# EasyEDA Pro project 电动自行车定位监测终端_v1.0.0.epro, schematic 主板原理图

## Sheets
1 主控芯片: Create Date: 2023-09-03; Page Name: 主控芯片; Project Name: 电动自行车定位监测终端; Schematic Name: 主板原理图; Update Date: 2023-09-07; Company: 合肥工业大学; Drawed: 商文涛; Page Size: A4; Reviewed: 商文涛 / 刘磊; Version: V1.0
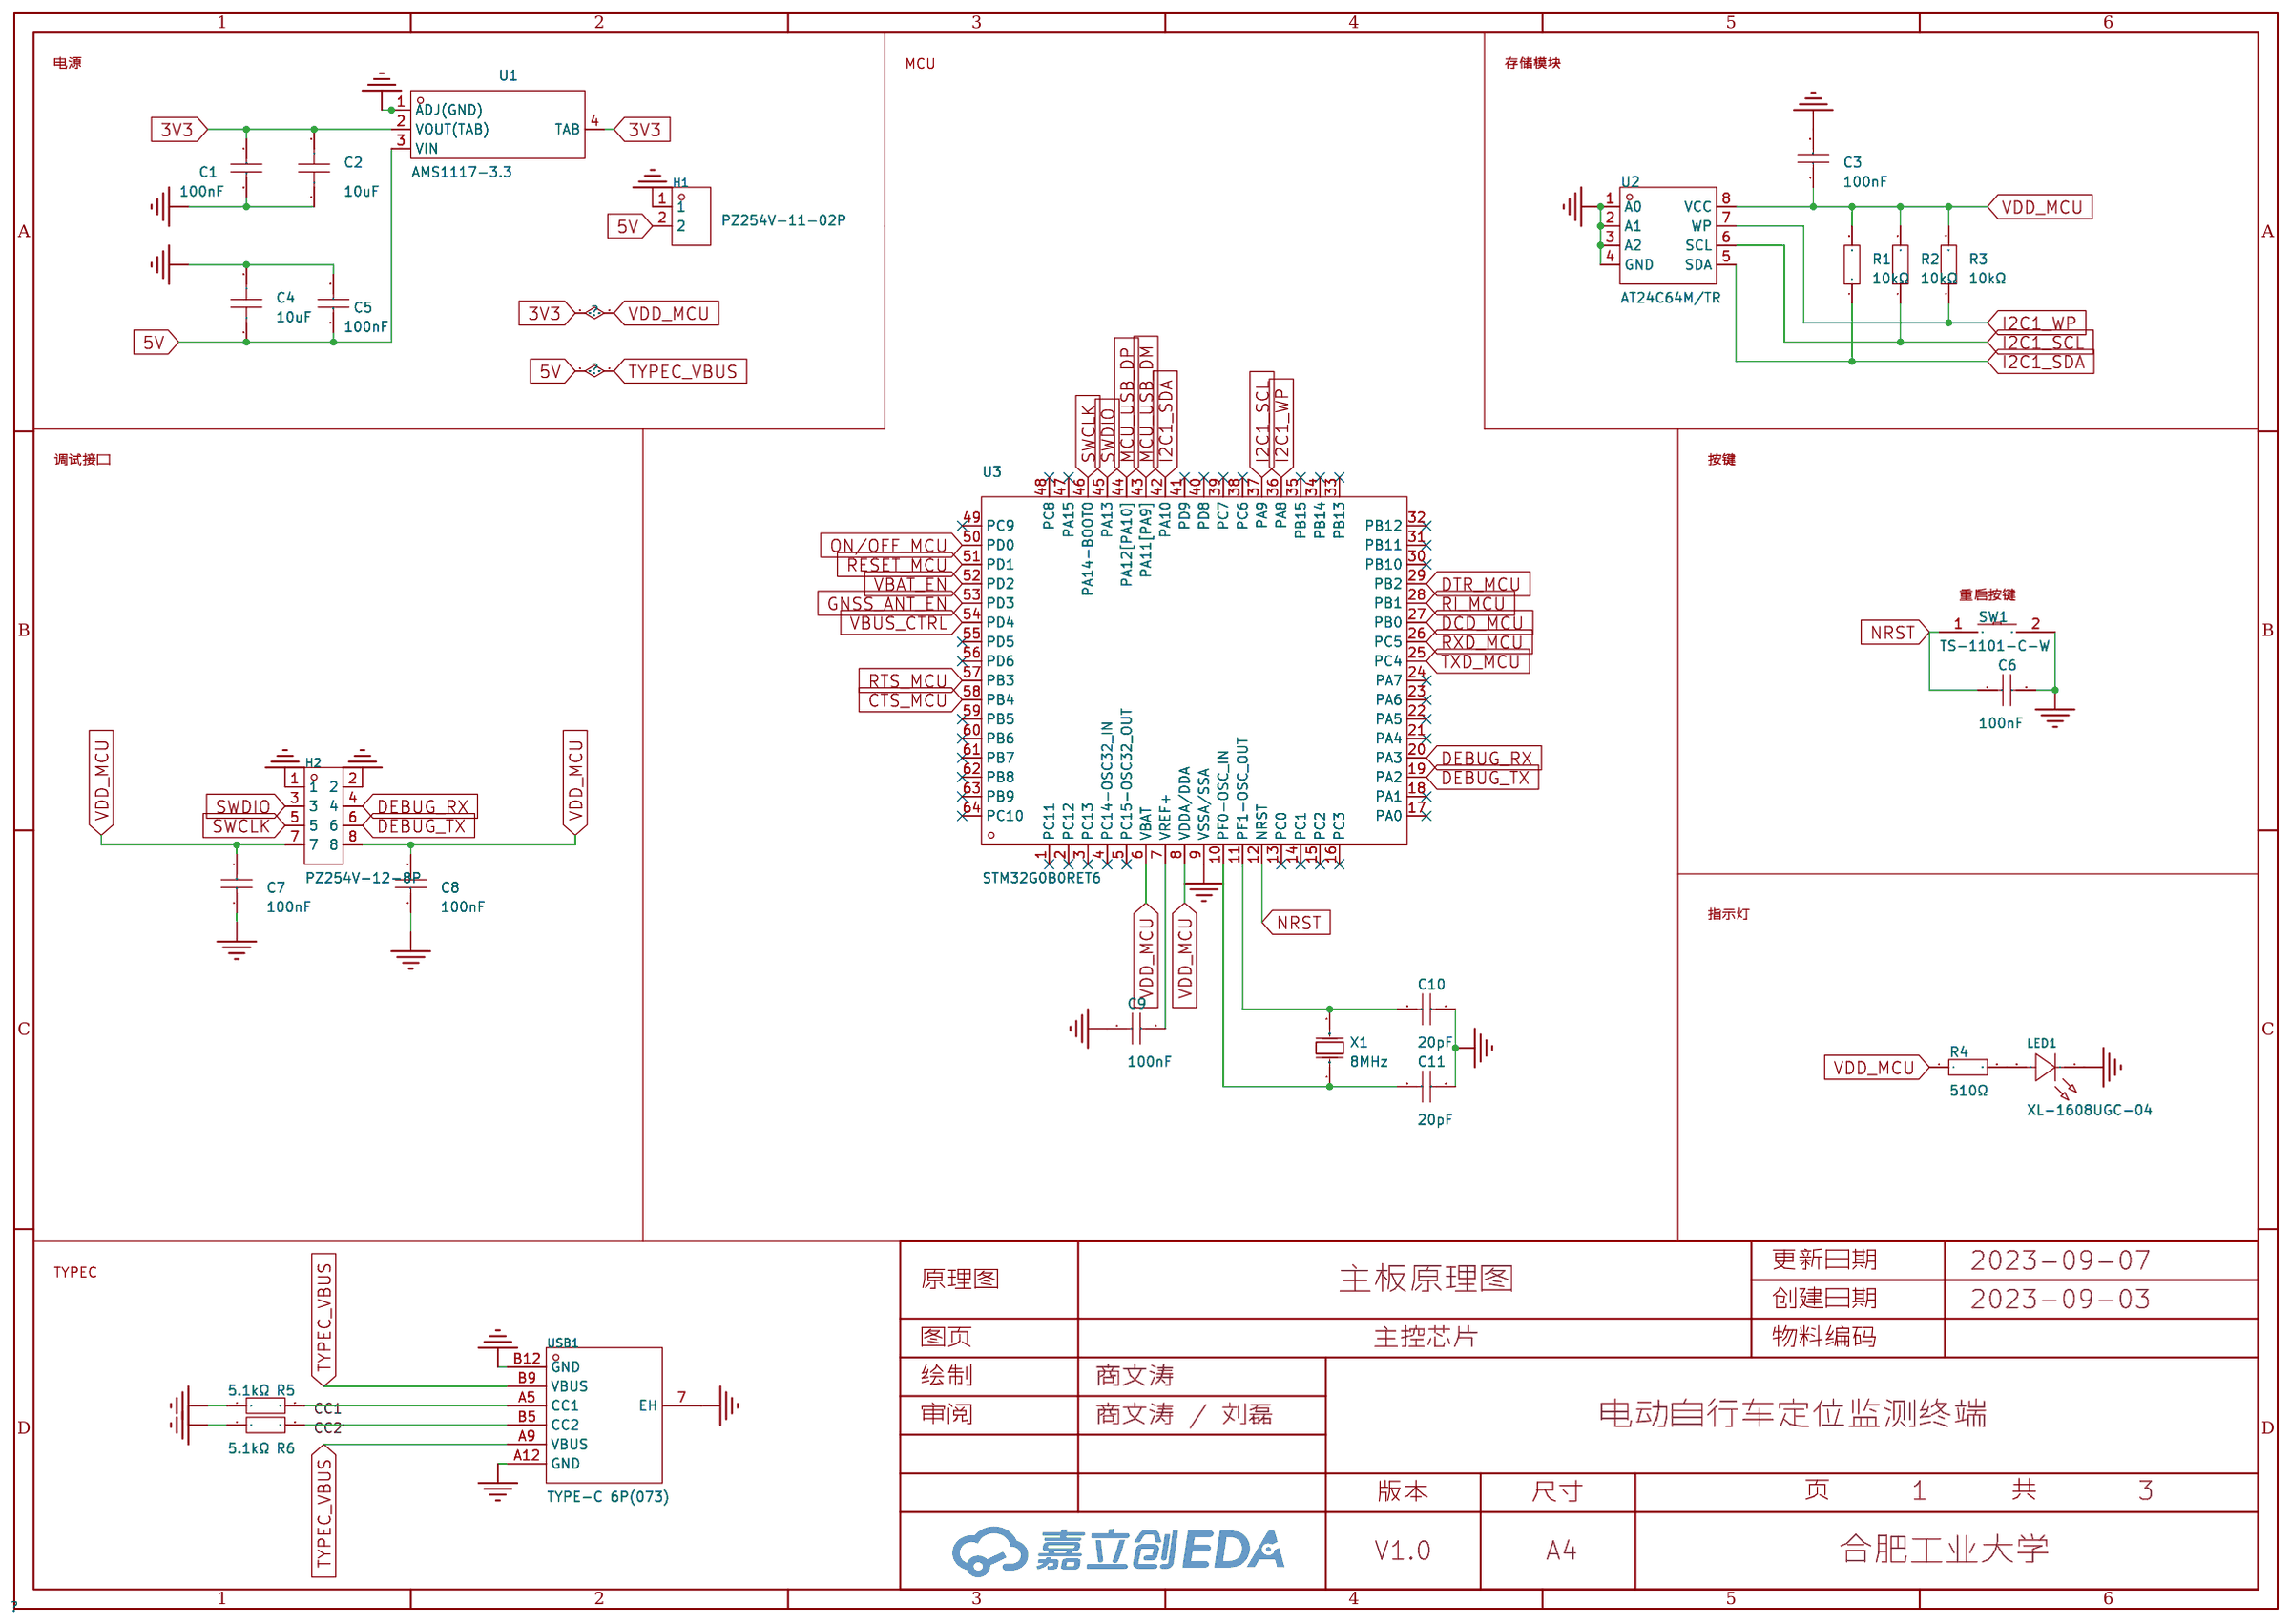
[diagram p0: 主控芯片]
2 数传芯片: Create Date: 2023-09-04; Page Name: 数传芯片; Update Date: 2023-09-06
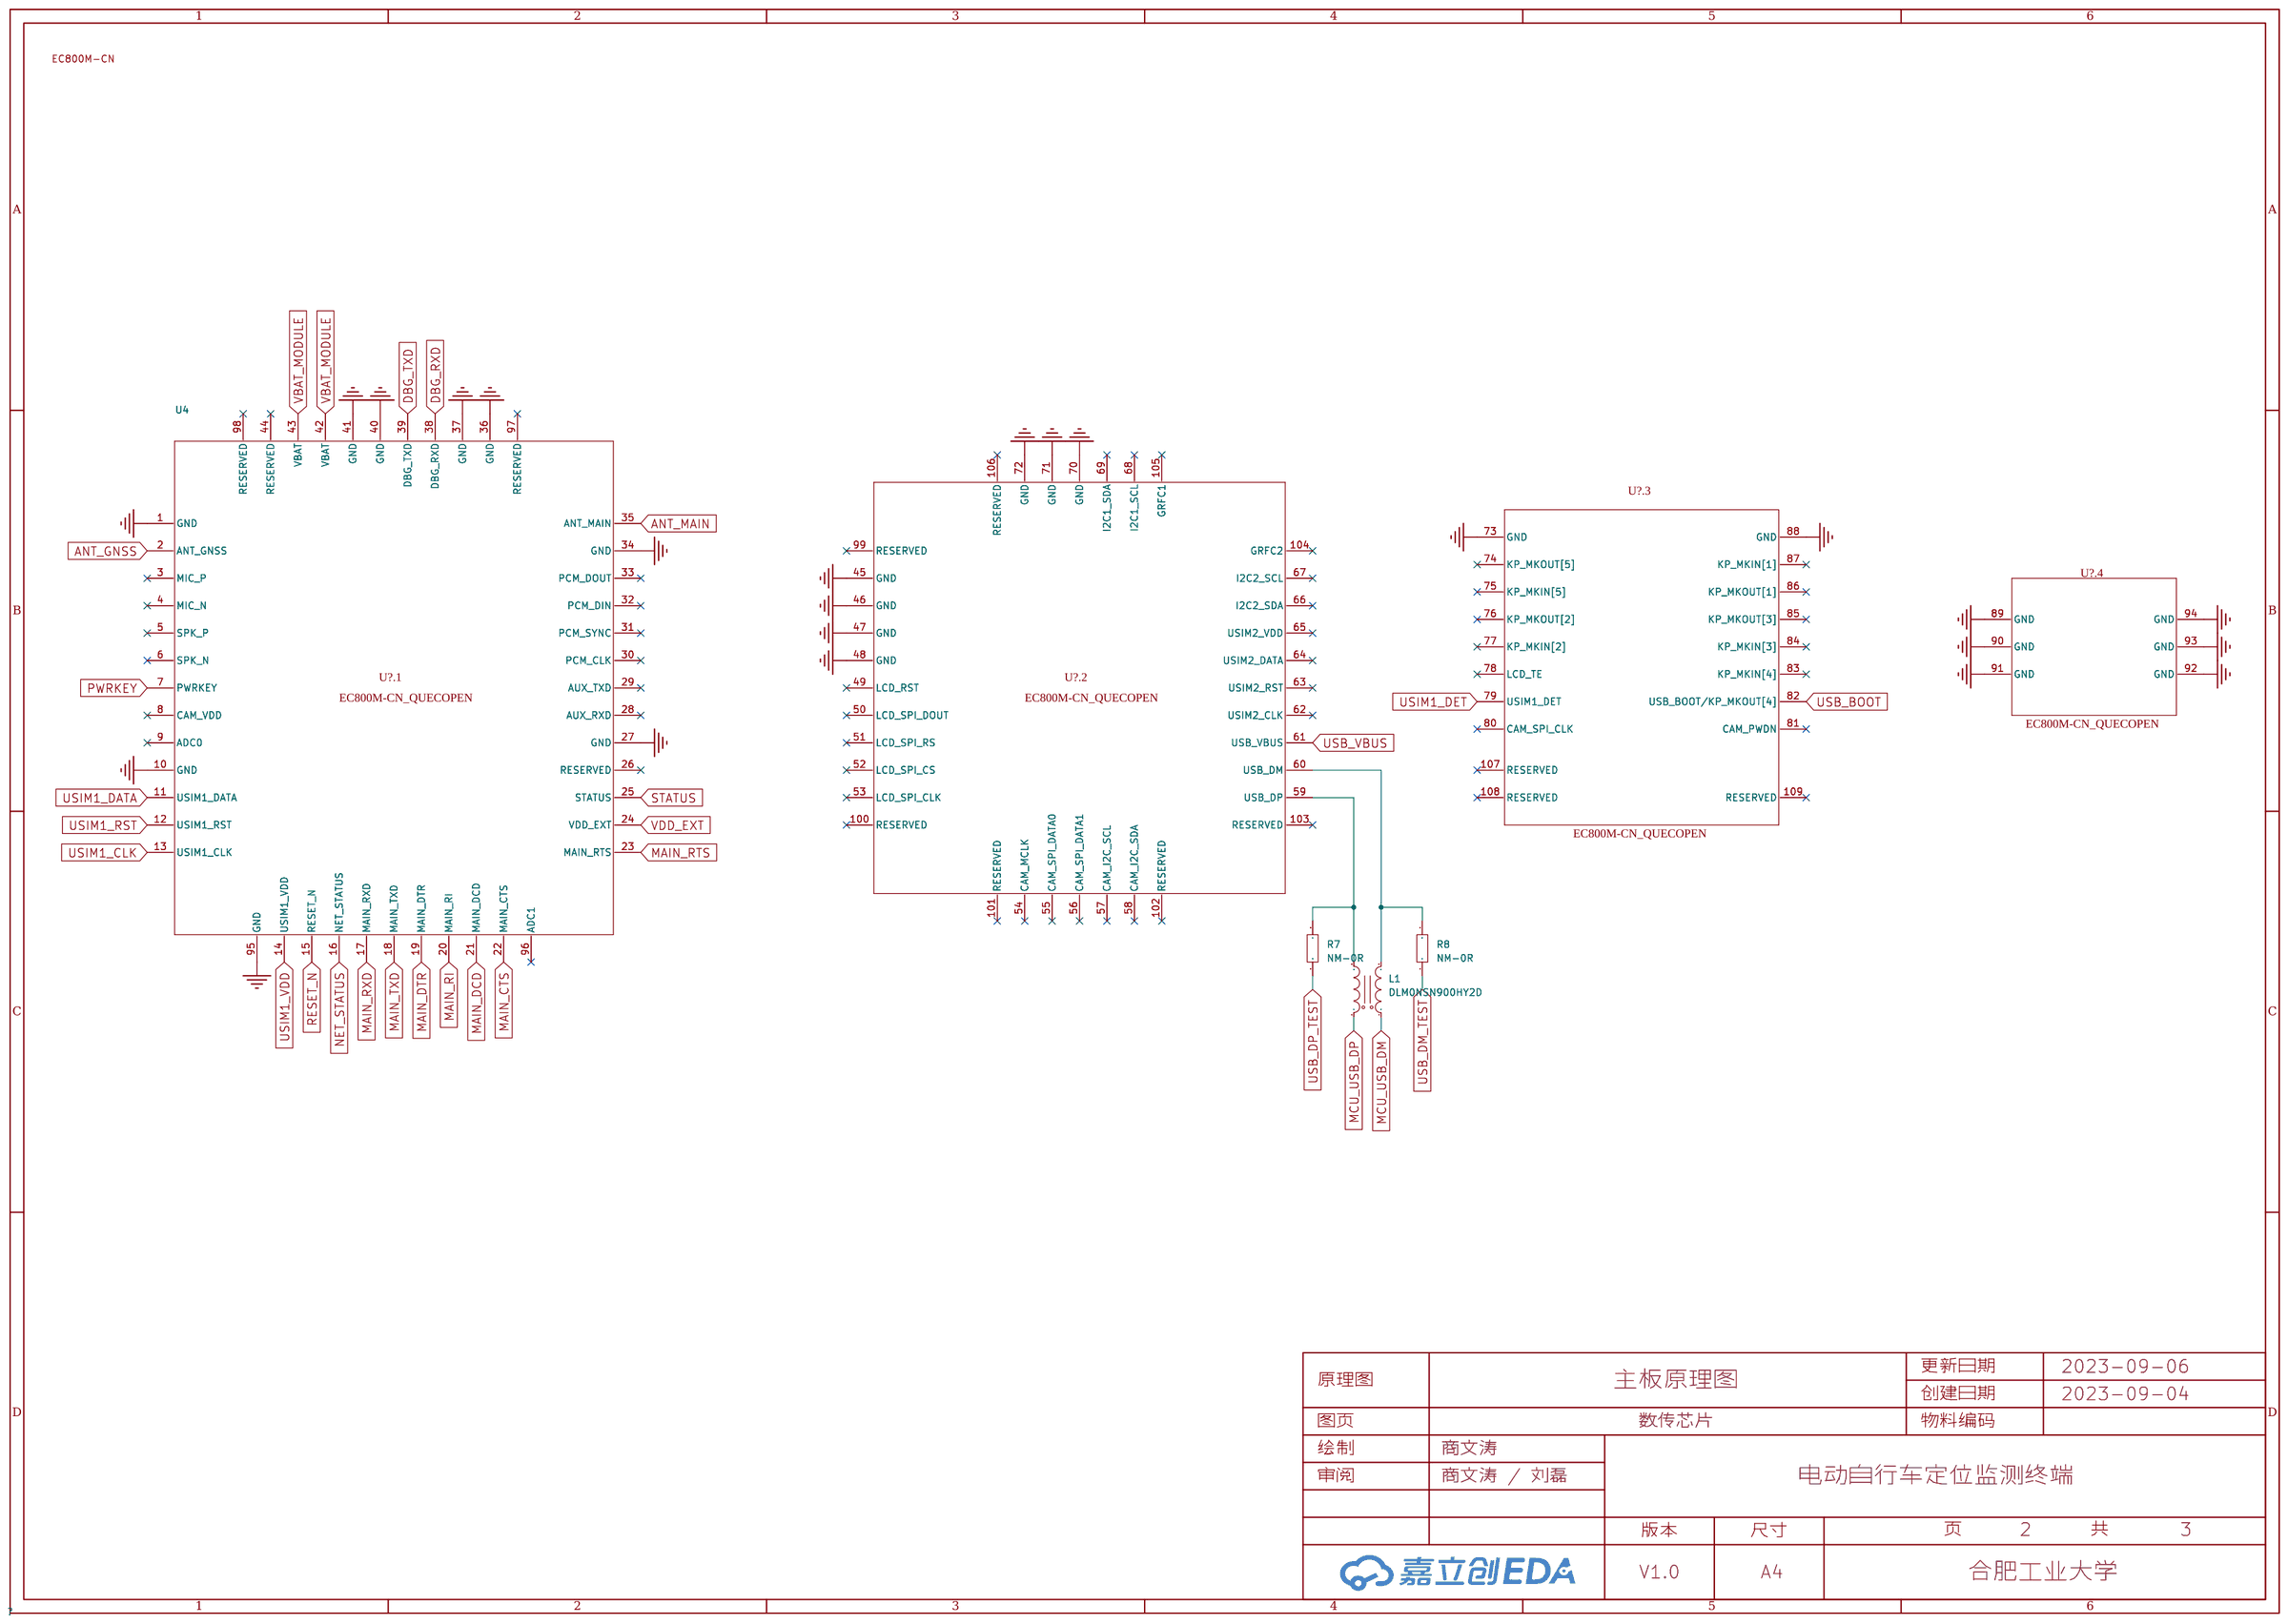
[diagram p1: 数传芯片]
3 功能模块: Create Date: 2023-09-04; Page Name: 功能模块
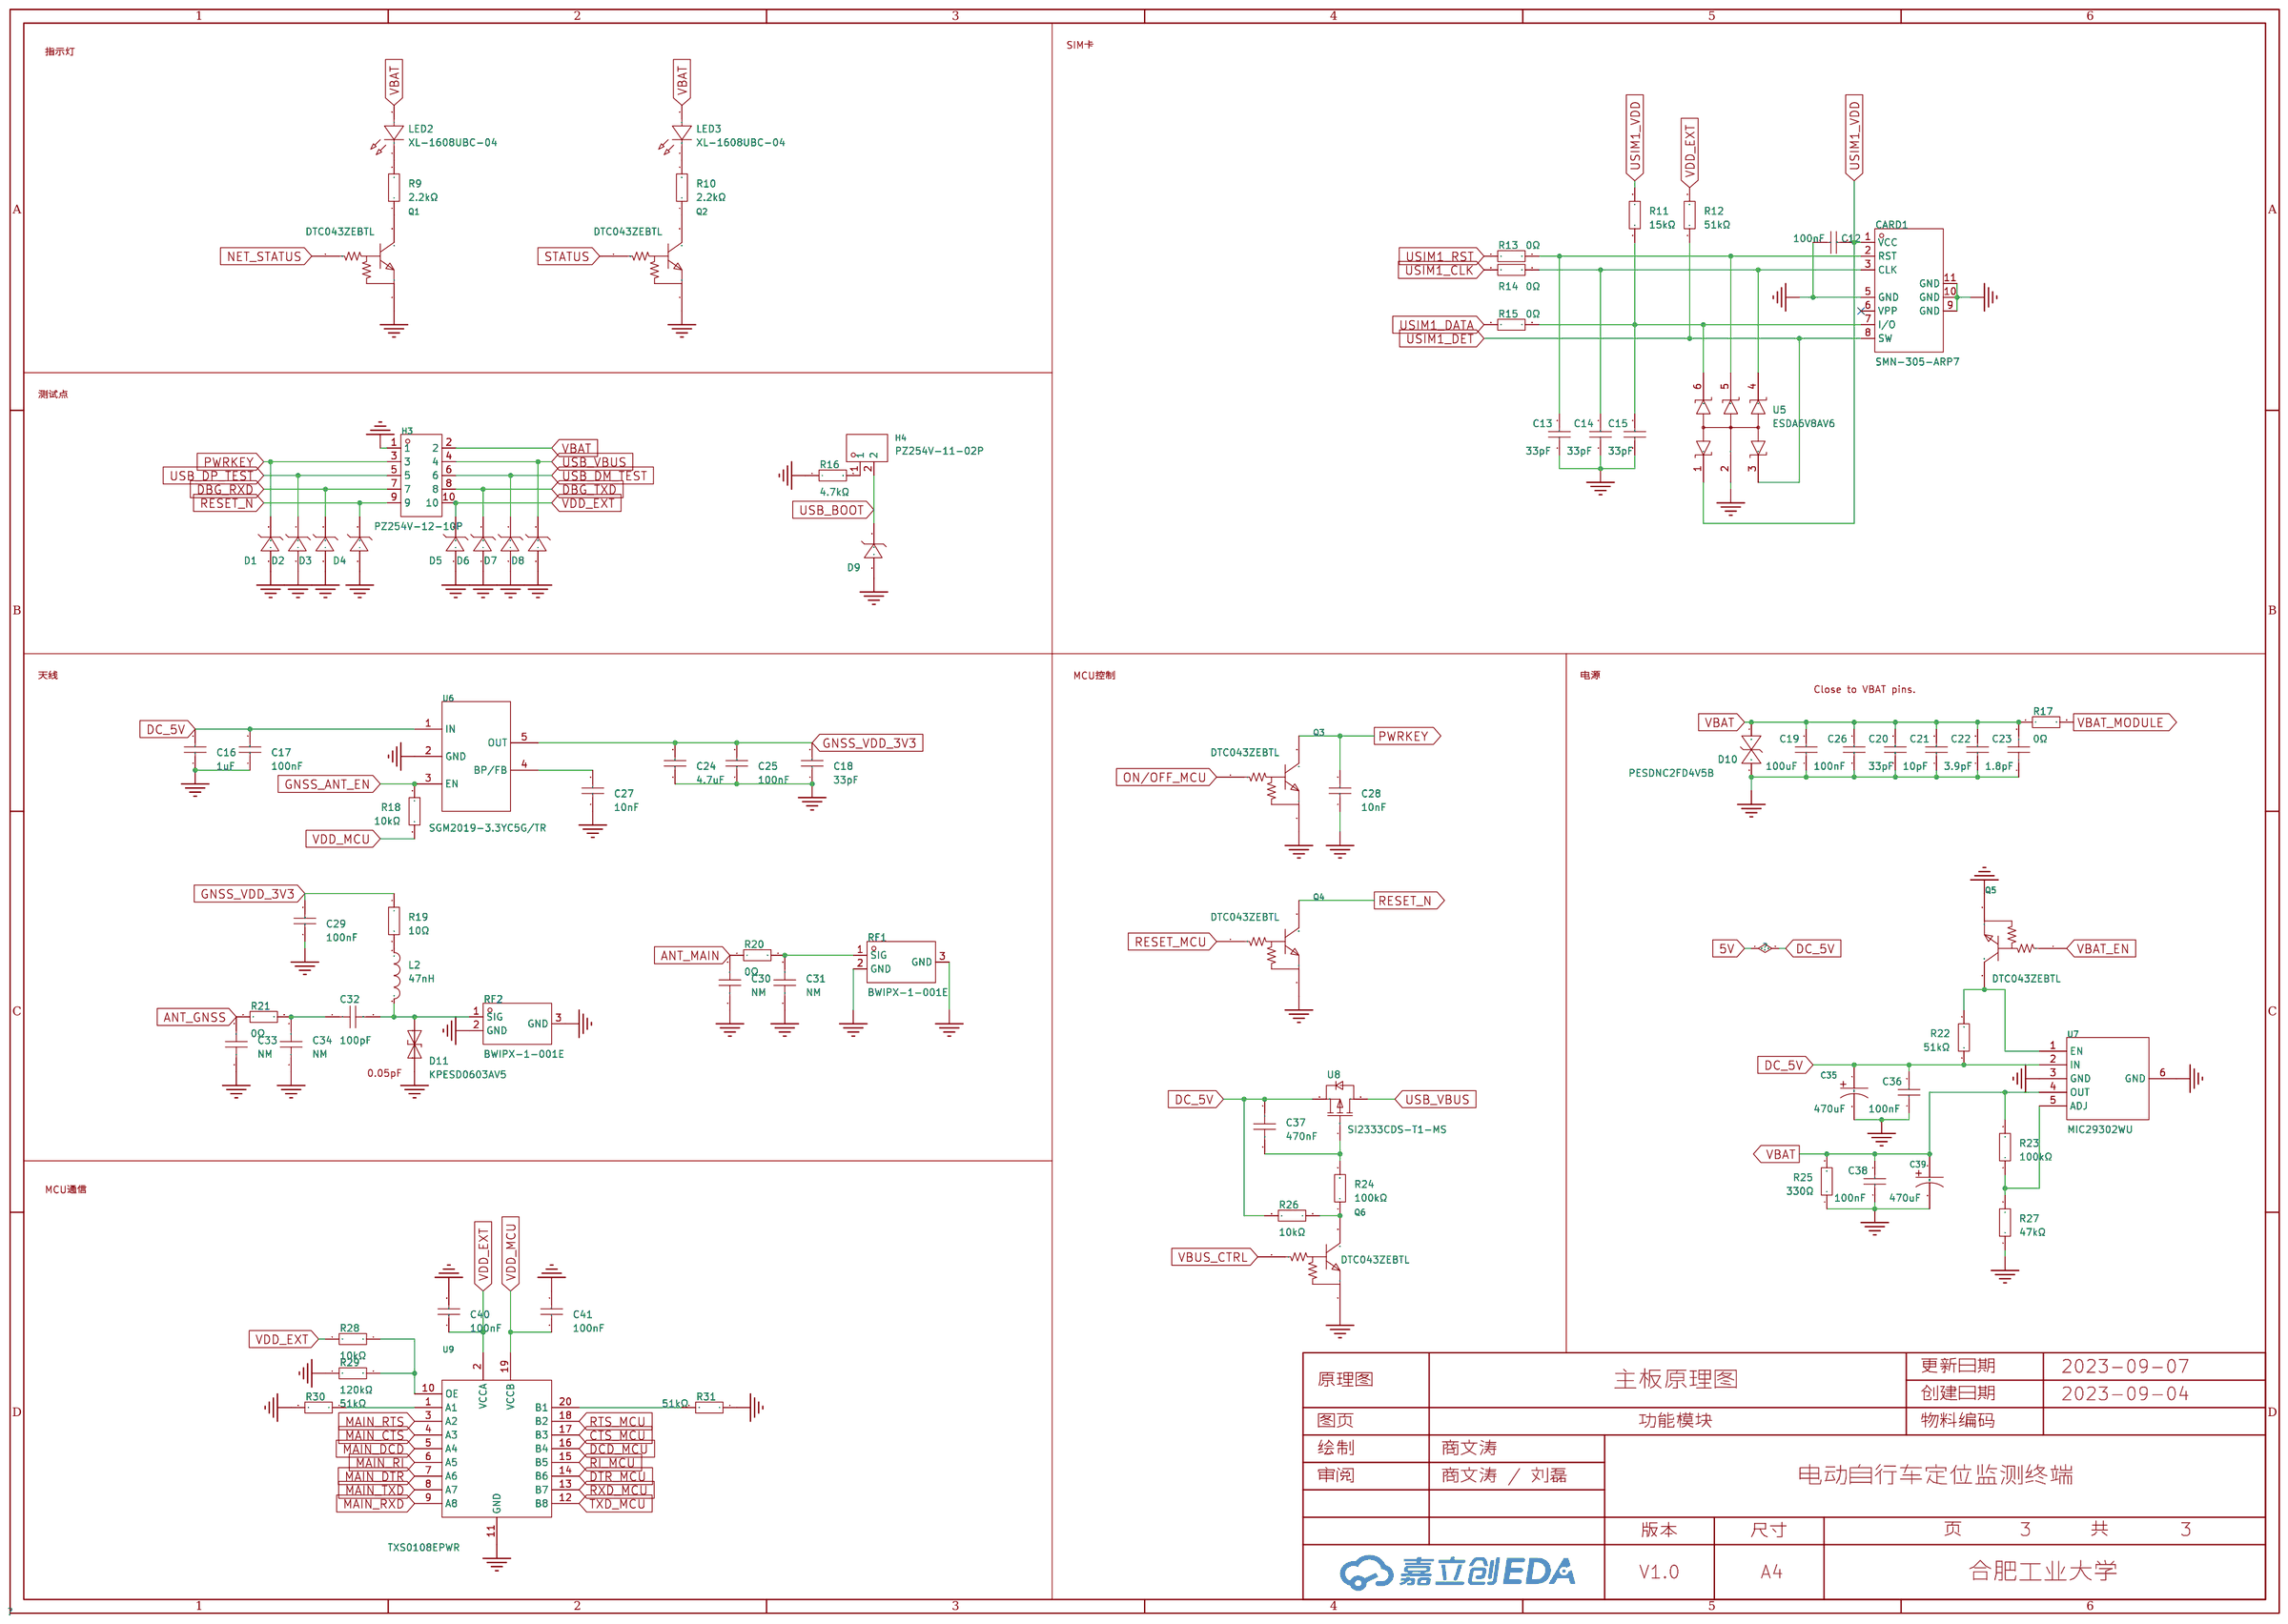
[diagram p2: 功能模块]

## Parts
sheet 主控芯片
C1  100nF  [C0603]
C2  10uF  [C0603]
C3  100nF  [C0603]
C4  10uF  [C0603]
C5  100nF  [C0603]
C6  100nF  [C0603]
C7  100nF  [C0603]
C8  100nF  [C0603]
C9  100nF  [C0603]
C10  20pF  [C0603]
C11  20pF  [C0603]
H1  PZ254V-11-02P  [HDR-TH_2P-P2.54-V-M]  (no BOM)
H2  PZ254V-12-8P  [HDR-TH_8P-P2.54-V-M-R2-C4-S2.54]  (no BOM)
LED1  XL-1608UGC-04  [LED0603-RD_GREEN]
R1  10kΩ  [R0603]
R2  10kΩ  [R0603]
R3  10kΩ  [R0603]
R4  510Ω  [R0603]
R5  5.1kΩ  [R0603]
R6  5.1kΩ  [R0603]
SW1  TS-1101-C-W  [SW-SMD_L6.0-W3.3-LS8.0]
U1  AMS1117-3.3  [SOT-223-4_L6.5-W3.5-P2.30-LS7.0-BR]
U2  AT24C64M/TR  [SOP-8_L4.9-W3.9-P1.27-LS6.0-BL]
U3  STM32G0B0RET6  [LQFP-64_L10.0-W10.0-P0.50-LS12.0-BL]  (no BOM)
USB1  TYPE-C 6P(073)  [TYPE-C-SMD_TYPE-C-6P]
X1  8MHz  [CRYSTAL-SMD_L5.0-W3.2]
sheet 功能模块
C12  100nF  [C0603]
C13  33pF  [C0603]
C14  33pF  [C0603]
C15  33pF  [C0603]
C16  1uF  [C0603]
C17  100nF  [C0603]
C18  33pF  [C0603]
C19  100uF  [C1206]
C20  33pF  [C0603]
C21  10pF  [C0603]
C22  3.9pF  [C0603]
C23  1.8pF  [C0603]
C24  4.7uF  [C0603]
C25  100nF  [C0603]
C26  100nF  [C0603]
C27  10nF  [C0603]
C28  10nF  [C0603]
C29  100nF  [C0603]
C30  NM  [C0603]  (no BOM)
C31  NM  [C0603]  (no BOM)
C32  100pF  [C0603]
C33  NM  [C0603]  (no BOM)
C34  NM  [C0603]  (no BOM)
C35  470uF  [CAP-SMD_BD6.3-L6.6-W6.6-FD]
C36  100nF  [C0603]
C37  470nF  [C0603]
C38  100nF  [C0603]
C39  470uF  [CAP-SMD_BD6.3-L6.6-W6.6-FD]
C40  100nF  [C0603]
C41  100nF  [C0603]
CARD1  SMN-305-ARP7  [NANO-SIM-SMD_SMN-305-ARP7]
D1  ESD9L5.0ST5G  [SOD-923_L0.8-W0.6-LS1.0-RD]
D2  ESD9L5.0ST5G  [SOD-923_L0.8-W0.6-LS1.0-RD]
D3  ESD9L5.0ST5G  [SOD-923_L0.8-W0.6-LS1.0-RD]
D4  ESD9L5.0ST5G  [SOD-923_L0.8-W0.6-LS1.0-RD]
D5  ESD9L5.0ST5G  [SOD-923_L0.8-W0.6-LS1.0-RD]
D6  ESD9L5.0ST5G  [SOD-923_L0.8-W0.6-LS1.0-RD]
D7  ESD9L5.0ST5G  [SOD-923_L0.8-W0.6-LS1.0-RD]
D8  ESD9L5.0ST5G  [SOD-923_L0.8-W0.6-LS1.0-RD]
D9  ESD9L5.0ST5G  [SOD-923_L0.8-W0.6-LS1.0-RD]
D10  PESDNC2FD4V5B  [DFN1006-2L-BI]
D11  KPESD0603AV5  [D0603-BI-A]
H3  PZ254V-12-10P  [HDR-TH_10P-P2.54-V-M-R2-C5-S2.54]  (no BOM)
H4  PZ254V-11-02P  [HDR-TH_2P-P2.54-V-M]  (no BOM)
L2  47nH  [L0603]
LED2  XL-1608UBC-04  [LED0603-RD_BLUE]
LED3  XL-1608UBC-04  [LED0603-RD_BLUE]
Q1  DTC043ZEBTL  [SOT-416_L1.6-W0.8-P1.00-LS1.6-BR]
Q2  DTC043ZEBTL  [SOT-416_L1.6-W0.8-P1.00-LS1.6-BR]
Q3  DTC043ZEBTL  [SOT-416_L1.6-W0.8-P1.00-LS1.6-BR]
Q4  DTC043ZEBTL  [SOT-416_L1.6-W0.8-P1.00-LS1.6-BR]
Q5  DTC043ZEBTL  [SOT-416_L1.6-W0.8-P1.00-LS1.6-BR]
Q6  DTC043ZEBTL  [SOT-416_L1.6-W0.8-P1.00-LS1.6-BR]
R9  2.2kΩ  [R0603]
R10  2.2kΩ  [R0603]
R11  15kΩ  [R0603]
R12  51kΩ  [R0603]
R13  0Ω  [R0603]
R14  0Ω  [R0603]
R15  0Ω  [R0603]
R16  4.7kΩ  [R0603]
R17  0Ω  [R0805]
R18  10kΩ  [R0603]
R19  10Ω  [R0603]
R20  0Ω  [R0603]
R21  0Ω  [R0603]
R22  51kΩ  [R0603]
R23  100kΩ  [R0603]
R24  100kΩ  [R0603]
R25  330Ω  [R0603]
R26  10kΩ  [R0603]
R27  47kΩ  [R0603]
R28  10kΩ  [R0603]
R29  120kΩ  [R0603]
R30  51kΩ  [R0603]
R31  51kΩ  [R0603]
RF1  BWIPX-1-001E  [IPEX-SMD_BWIPX-1-001E]
RF2  BWIPX-1-001E  [IPEX-SMD_BWIPX-1-001E]
U5  ESDA6V8AV6  [SOT-563-6_L1.6-W1.2-P0.50-LS1.6-BL]
U6  SGM2019-3.3YC5G/TR  [SC-70-5_L2.1-W1.3-P0.65-LS2.1-BR]
U7  MIC29302WU  [TO-263-5_L10.1-W8.7-P1.70-LS15.2-BR]
U8  SI2333CDS-T1-MS  [SOT-23-3_L3.0-W1.6-P1.90-LS2.8-BR]
U9  TXS0108EPWR  [TSSOP-20_L6.5-W4.4-P0.65-LS6.4-BL]
sheet 数传芯片
L1  DLM0NSN900HY2D  [FILTER-SMD_4P-L0.9-W0.7-P0.50-BL-CW]
R7  NM-0R  [R0603]  (no BOM)
R8  NM-0R  [R0603]  (no BOM)
U4  -  [EC800M-CN_QuecOpen]  (no BOM)

## Library data of the parts
C1 C3 C5-C9 C12 C17 C25 C26 C29 C36 C38 C40 C41 = 0603B104K500NT: 容值:100nF;精度:±10%;额定电压:50V;材质(温度系数):X7R;; LCSC Part Name: 100nF ±10% 50V; Supplier Part: C30926; Manufacturer: FH(风华); Supplier Footprint: 0603; Datasheet: https://atta.szlcsc.com/upload/public/pdf/source/20170923/C30926_1506149436298988724.pdf; Supplier: LCSC; Tolerance: ±10%; Voltage Rated: 50V; Temperature Coefficient: X7R
C2 C4 = CL10A106MQ8NNNC: 容值:10uF;精度:±20%;额定电压:6.3V;材质(温度系数):X5R;; LCSC Part Name: 10uF ±20% 6.3V; Supplier Part: C1691; Manufacturer: SAMSUNG(三星); Supplier Footprint: 0603; Datasheet: https://atta.szlcsc.com/upload/public/pdf/source/20160103/1457707690948.pdf; Supplier: LCSC; Tolerance: ±20%; Voltage Rated: 6.3V; Temperature Coefficient: X5R
C10 C11 = CC0603JRNPO9BN200: 容值:20pF;精度:±5%;额定电压:50V;材质(温度系数):NP0;; LCSC Part Name: 20pF ±5% 50V; Supplier Part: C105621; Manufacturer: YAGEO(国巨); Supplier Footprint: 0603; Datasheet: https://atta.szlcsc.com/upload/public/pdf/source/20170425/1493115771885.pdf; Supplier: LCSC; Tolerance: ±5%; Voltage Rated: 50V; Temperature Coefficient: NP0
H1 H4 = PZ254V-11-02P: 排数:单排;总PIN位数:2P;间距:2.54mm;插针结构:1x2P;行距:-;安装类型:直插;圆针/方针:方针;额定电流:-;额定电压:-;配合针长度:6mm;塑高:2.5mm;端接针长度:3mm;触头材质:黄铜;触头镀层:-;工作温度范围:-40℃~+105℃;颜色:黑色;; LCSC Part Name: 2.54mm 1x2P 直插 方针; Supplier Part: C492401; Manufacturer: XFCN(兴飞); Supplier Footprint: 插件,P=2.54mm; Datasheet: https://atta.szlcsc.com/upload/public/pdf/source/20200309/C492401_A812433581A9B211A7FFA413ADDFF0E5.pdf; Supplier: LCSC; Number of Rows: 单排; Number of Pins: 2P; Pitch: 2.54mm; Pin Structure: 1x2P; Mounting Type: 直插; Circluar Pins/Square Pins: 方针; Length of Mating Pin: 6mm; Insulation Height: 2.5mm; Length of End Connection Pin: 3mm; Contact Material: 黄铜; Operating Temperature Range: -40℃~+105℃; Color: 黑色
H2 = PZ254V-12-8P: 排数:双排;总PIN位数:8P;间距:2.54mm;插针结构:2x4P;行距:2.54mm;安装类型:直插;圆针/方针:方针;额定电流:-;额定电压:-;配合针长度:6mm;塑高:2.5mm;端接针长度:3mm;触头材质:黄铜;触头镀层:-;工作温度范围:-40℃~+105℃;颜色:黑色;; LCSC Part Name: 2.54mm 2x4P 直插 方针; Supplier Part: C492421; Manufacturer: XFCN(兴飞); Supplier Footprint: 插件,P=2.54mm; Datasheet: https://atta.szlcsc.com/upload/public/pdf/source/20200309/C492421_DC8A206AF99CD7755BD4A5B0BC48200B.pdf; Supplier: LCSC; Number of Rows: 双排; Number of Pins: 8P; Pitch: 2.54mm; Pin Structure: 2x4P; Row Spacing: 2.54mm; Mounting Type: 直插; Circluar Pins/Square Pins: 方针; Length of Mating Pin: 6mm; Insulation Height: 2.5mm; Length of End Connection Pin: 3mm; Contact Material: 黄铜; Operating Temperature Range: -40℃~+105℃; Color: 黑色
LED1 = XL-1608UGC-04: 发光颜色:翠绿;透镜颜色:无色透明;主波长:516nm~525nm;色温:-;功率:80mW;发光角度:120°;安装方式:正贴;工作温度:-30℃~+85℃;; LCSC Part Name: 翠绿 正贴; Supplier Part: C965804; Manufacturer: XINGLIGHT(成兴光); Supplier Footprint: 0603; Datasheet: https://atta.szlcsc.com/upload/public/pdf/source/20221102/520D6E465E5CFD1609C8A4DBC80D4018.pdf; Supplier: LCSC; Emitted Color: 翠绿; Lens Color: 无色透明; Dominant Wavelength: 516nm~525nm; Peak Wavelength: 534nm; Forward Current: 25mA; Power Dissipation: 80mW; Viewing Angle: 120°; Mounting Sytle: 正贴; Operating Temperature: -30℃~+85℃
R1-R3 R18 R26 R28 = RS-03K103JT: 精度:±5%;温度系数:±100ppm/℃;阻值:10kΩ;功率:100mW;最大工作电压:50V;工作温度范围:-55℃~+155℃;; LCSC Part Name: 10KΩ(103) ±5%; Supplier Part: C73809; Manufacturer: FH(风华); Supplier Footprint: 0603; Datasheet: https://atta.szlcsc.com/upload/public/pdf/source/20160606/1465200211928.pdf; Supplier: LCSC; Tolerance: ±5%; Temperature Coefficient: ±100ppm/℃; Power(Watts): 100mW; Overload Voltage (Max): 50V; Operating Temperature Range: -55℃~+155℃
R4 = RS-03K511JT: 阻值:510Ω;精度:±5%;温度系数:±100ppm/℃;功率:100mW;最大工作电压:50V;工作温度范围:-55℃~+155℃;; LCSC Part Name: 510Ω ±5%; Supplier Part: C73811; Manufacturer: FH(风华); Supplier Footprint: 0603; Datasheet: https://atta.szlcsc.com/upload/public/pdf/source/20160606/1465200212042.pdf; Supplier: LCSC; Tolerance: ±5%; Temperature Coefficient: ±100ppm/℃; Power(Watts): 100mW; Overload Voltage (Max): 50V; Operating Temperature Range: -55℃~+155℃
R5 R6 = RS-03K512JT: 阻值:5.1kΩ;精度:±5%;功率:100mW;温度系数:±100ppm/℃;; LCSC Part Name: 5.1kΩ ±5% 100mW; Supplier Part: C73801; Manufacturer: FH(风华); Supplier Footprint: 0603; Datasheet: https://atta.szlcsc.com/upload/public/pdf/source/20160606/1465200211489.pdf; Supplier: LCSC; Tolerance: ±5%; Power(Watts): 100mW; Temperature Coefficient: ±100ppm/℃; Overload Voltage (Max): 50V; Operating Temperature Range: -55℃~+155℃
SW1 = TS-1101-C-W: 触点电流:50mA;额定电压(AC):-;额定电压(DC):12V;额定功率:-;绝缘电阻:-;电路结构:单刀单掷;安装方式:立贴;带灯:无;作用力:260gf;机械寿命:5万次;带支架:否;; LCSC Part Name: 立贴 6*3.6*2.5mm 轻触开关 一型3*6*2.5有白ZD b拉伸白色带淡绿按键 卷装; Supplier Part: C318938; Manufacturer: XKB Connectivity(中国星坤); Supplier Footprint: SMD; Datasheet: https://atta.szlcsc.com/upload/public/pdf/source/20200227/C318938_C2E53B1EEDE37D980A33616AC086DE53.pdf; Supplier: LCSC; Contact Current: 50mA; Voltage Rating (DC): 12V; Circuit: 单刀单掷; Mounting Style: 立贴; Actuator Style: 矩形按钮; Actuator/Cap Color: 白色带淡绿; With Lamp: 无; Operating Force: 260gf; Mechanical Life: 5万次; Operating Temperature: -30℃~+85℃; Switch Length: 6mm; Switch Width: 3.6mm; Switch Height: 2.5mm; Strike Gundam: 否
U1 = AMS1117-3.3_C347222: 输出类型:固定;输出极性:正;最大输入电压:18V;输出电压:3.3V;输出电流:1A;电源纹波抑制比(PSRR):60dB@(120Hz);; Supplier Part: C347222; Manufacturer: UMW(广东友台半导体); Supplier Footprint: SOT-223; Datasheet: https://atta.szlcsc.com/upload/public/pdf/source/20211011/50CC665C22E3A66C08379A4A74BDA25C.pdf; Supplier: LCSC; Output Type: 固定; Output Polarity: 正; Number of Outputs: 1; Maximum Input Voltage: 18V; Output Voltage: 3.3V; Dropout Voltage: 1.3V@(1A); Output Current: 1A; Power Supply Rejection Ratio (PSRR): 60dB@(120Hz)
U2 = AT24C64M/TR: Supplier Part: C434512; Manufacturer: HGSEMI(华冠); Supplier Footprint: SOP-8; Datasheet: https://atta.szlcsc.com/upload/public/pdf/source/20191028/C434512_C0198027D15CBA88B21271CD1BA19E46.pdf; Supplier: LCSC
U3 = STM32G0B0RET6: CPU内核：ARM-M系列 CPU最大主频：64MHz 工作电压范围：2V~3.6V 程序存储容量：512KB GPIO端口数量：59; LCSC Part Name: ARM Cortex-M0 64MHz; Supplier Part: C3230954; Manufacturer: ST(意法半导体); Supplier Footprint: LQFP-64; JLCPCB Part Class: 扩展库; Supplier: LCSC; CPU Core: ARM Cortex-M0; Maximum Frequency: 64MHz; Supply Voltage Range: 2V~3.6V; Internal Oscillator: 有; Program FLASH Size: 512K@x8bit; RAM Size: 144KB; GPIO Ports Number: 59; ADC (Units/Channels/bits): 1@x19ch/12bit; Peripherals / Functions / Protocol Stacks: DMA；看门狗；POR；PWM; Operating Temperature Range: -40℃~+85℃
USB1 = TYPE-C 6P(073): 连接器类型:Type-C;标准:-;公母:母座;触点数量:6P;端口数量:1;安装方式:卧贴;额定电流 - 电源:5A;工作温度范围:-25℃~+85℃;; LCSC Part Name: Type-C 母座 卧贴; Supplier Part: C668623; Manufacturer: SHOU HAN(首韩); Supplier Footprint: SMD; JLCPCB Part Class: Extended Part; Datasheet: https://atta.szlcsc.com/upload/public/pdf/source/20200618/C668623_A4B260DED7AC1949BAC6AE39E9F4CD80.pdf; Supplier: LCSC; Connector Type: Type-C; Gender: 母座; Number of Contacts: 6P; Number of Ports: 1; Mounting Style: 卧贴; Current Rating - Power (Max): 5A; Operating Temperature Range: -25℃~+85℃
X1 = X50328MSB2GI: 频率:8MHz;频率公差:±10ppm;负载电容:20pF;; LCSC Part Name: 8MHz ±10ppm 20pF YSX530GA YSX530GA; Supplier Part: C115962; Manufacturer: YXC(扬兴晶振); Supplier Footprint: SMD5032-2P; Datasheet: https://atta.szlcsc.com/upload/public/pdf/source/20230220/0EBFFB9D6D8CE6A211407822BBB6C516.pdf; Supplier: LCSC; Crystal Type: 贴片无源晶振; Frequency Tolerance: ±10ppm; Frequency Stability: ±50ppm; Load Capacitance: 20pF; Operating Temperature: -40℃~+85℃
C13-C15 C18 C20 = CC0603JRNPO9BN330: 容值:33pF;精度:±5%;额定电压:50V;材质(温度系数):NP0;; LCSC Part Name: 33pF ±5% 50V; Supplier Part: C107047; Manufacturer: YAGEO(国巨); Supplier Footprint: 0603; Datasheet: https://atta.szlcsc.com/upload/public/pdf/source/20170420/1492670693688.pdf; Supplier: LCSC; Tolerance: ±5%; Voltage Rated: 50V; Temperature Coefficient: NP0
C16 = 0603B105K250NT: 容值:1uF;精度:±10%;额定电压:25V;材质(温度系数):X7R;; LCSC Part Name: 1uF ±10% 25V; Supplier Part: C59302; Manufacturer: FH(风华); Supplier Footprint: 0603; Datasheet: https://atta.szlcsc.com/upload/public/pdf/source/20170923/C59302_1506149498957988854.pdf; Supplier: LCSC; Tolerance: ±10%; Voltage Rated: 25V; Temperature Coefficient: X7R
C19 = CL31A107MQHNNNE: 容值:100uF;精度:±20%;额定电压:6.3V;材质(温度系数):X5R;; LCSC Part Name: 100uF ±20% 6.3V; Supplier Part: C15008; Manufacturer: SAMSUNG(三星); Supplier Footprint: 1206; Datasheet: https://atta.szlcsc.com/upload/public/pdf/source/20160103/1457707673200.pdf; Supplier: LCSC; Tolerance: ±20%; Voltage Rated: 6.3V; Temperature Coefficient: X5R
C21 = CC0603JRNPO9BN100: 容值:10pF;精度:±5%;额定电压:50V;材质(温度系数):NP0;; LCSC Part Name: 10pF ±5% 50V; Supplier Part: C106245; Manufacturer: YAGEO(国巨); Supplier Footprint: 0603; Datasheet: https://atta.szlcsc.com/upload/public/pdf/source/20170505/1493957837406.pdf; Supplier: LCSC; Tolerance: ±5%; Voltage Rated: 50V; Temperature Coefficient: NP0
C22 = 0603CG3R9C500NT: 容值:3.9pF;额定电压:50V;材质(温度系数):C0G;; LCSC Part Name: 3.9pF 50V ±0.25pF; Supplier Part: C1662; Manufacturer: FH(风华); Supplier Footprint: 0603; Datasheet: https://atta.szlcsc.com/upload/public/pdf/source/20170923/C1662_1506149309154988450.pdf; Supplier: LCSC; Voltage Rated: 50V; Temperature Coefficient: C0G
C23 = TCC0603COG1R8C500CT: 容值:1.8pF;额定电压:50V;材质(温度系数):C0G;; LCSC Part Name: 1.8pF 50V ±0.25pF; Supplier Part: C376773; Manufacturer: CCTC(三环); Supplier Footprint: 0603; Datasheet: https://atta.szlcsc.com/upload/public/pdf/source/20190327/C376773_8DC27DBAB69D1B4D94F35893D720915C.pdf; Supplier: LCSC; Voltage Rated: 50V; Temperature Coefficient: C0G
C24 = CL10A475KP8NNNC: 容值:4.7uF;精度:±10%;额定电压:10V;材质(温度系数):X5R;; LCSC Part Name: 4.7uF ±10% 10V; Supplier Part: C1705; Manufacturer: SAMSUNG(三星); Supplier Footprint: 0603; Datasheet: https://atta.szlcsc.com/upload/public/pdf/source/20160103/1457707692180.pdf; Supplier: LCSC; Tolerance: ±10%; Voltage Rated: 10V; Temperature Coefficient: X5R
C27 C28 = CC0603KRX7R9BB103: 容值:10nF;精度:±10%;额定电压:50V;材质(温度系数):X7R;; LCSC Part Name: 10nF ±10% 50V; Supplier Part: C100042; Manufacturer: YAGEO(国巨); Supplier Footprint: 0603; Datasheet: https://atta.szlcsc.com/upload/public/pdf/source/20180326/C100042_E8B0111D51DE3671A0A4A59FBCEFE81C.pdf; Supplier: LCSC; Tolerance: ±10%; Voltage Rated: 50V; Temperature Coefficient: X7R
C30 C31 C33 C34 = CAP_0603: Supplier Footprint: 0603
C32 = CC0603JRNPO9BN101: 容值:100pF;精度:±5%;额定电压:50V;材质(温度系数):NP0;; LCSC Part Name: 100pF ±5% 50V; Supplier Part: C14665; Manufacturer: YAGEO(国巨); Supplier Footprint: 0603; Datasheet: https://atta.szlcsc.com/upload/public/pdf/source/20180228/C14665_15198053087511377161.pdf; Supplier: LCSC; Tolerance: ±5%; Voltage Rated: 50V; Temperature Coefficient: NP0
C35 C39 = RVT1A471M0607_C335982: 容值:470uF;精度:±20%;额定电压:10V;电容体直径:6.3mm;电容体长度:7.7mm;纹波电流:-;等效串联电阻:-;工作寿命:2000hrs@105℃;工作温度:-45℃~+105℃;; LCSC Part Name: 470uF ±20% 10V; Supplier Part: C335982; Manufacturer: ROQANG(容强); Manufacturer Part: RVT1A471M0607; Supplier Footprint: SMD,6.3x7.7mm; Supplier: LCSC; Tolerance: ±20%; Rated Voltage: 10V; φD: 6.3mm; L: 7.7mm; Lifetime @ Temp: 2000hrs@105℃; Operating Temperature: -45℃~+105℃
C37 = 0603B474K160NT: 容值:470nF;精度:±10%;额定电压:16V;材质(温度系数):X7R;; LCSC Part Name: 470nF ±10% 16V; Supplier Part: C172757; Manufacturer: FH(风华); Supplier Footprint: 0603; Datasheet: https://atta.szlcsc.com/upload/public/pdf/source/20180125/C172757_15168700689581304686.pdf; Supplier: LCSC; Tolerance: ±10%; Voltage Rated: 16V; Temperature Coefficient: X7R
CARD1 = SMN-305-ARP7: 卡连接方式:翻盖式;卡类型:NanoSIM卡;连接器类型:卡座;本体最大高度:1.4mm;触头材质:C5191;触头镀层:金;工作温度范围:-25℃~+85℃;焊接温度(最大值):260℃;; LCSC Part Name: 翻盖式 NanoSIM卡 卡座 6+1; Supplier Part: C720512; Manufacturer: XUNPU(讯普); Supplier Footprint: SMD; Datasheet: https://atta.szlcsc.com/upload/public/pdf/source/20210906/1E62678A42BE1E594705537ECE0FD854.pdf; Supplier: LCSC; Card Connection Mode: 翻盖式; Card Type: NanoSIM卡; Connector Type: 卡座; Body Height (Max): 1.4mm; Contact Material: C5191; Contact Plating: 金; Operating Temperature Range: -25℃~+85℃; Welding Temperature (Max): 260℃
D1-D9 = ESD9L5.0ST5G: 极性:单向;反向截止电压(Vrwm):5V;击穿电压(VBR):5.4V;钳位电压(Vc)@Ipp:9.8V;; LCSC Part Name: 单向ESD; Supplier Part: C82326; Manufacturer: onsemi(安森美); Supplier Footprint: SOD-923-2; Datasheet: https://atta.szlcsc.com/upload/public/pdf/source/20170918/C82326_1505700201893975041.PDF; Supplier: LCSC; Polarity: 单向; Reverse Stand-Off Voltage (Vrwm): 5V; Breakdown Voltage (VBR): 5.4V; Peak Pulse Current(Ipp)@8/20us: 1A; Clamping Voltage@Ipp: 9.8V; Junction Capacitance(Cj)@1MHz: 0.5pF@1MHz; Operating Temperature: -55℃~+150℃@(Tj)
D10 = PESDNC2FD4V5B: Supplier Part: C496539; Manufacturer: Prisemi(芯导); Supplier Footprint: DFN1006-2L(0402); Datasheet: https://atta.szlcsc.com/upload/public/pdf/source/20200316/C496539_DE15BB95AADF482285988C2E29CAC2BB.pdf; Supplier: LCSC
D11 = KPESD0603AV5: Supplier Part: C2944167; Manufacturer: KUU; Supplier Footprint: 0603; Datasheet: https://atta.szlcsc.com/upload/public/pdf/source/20220114/CC7CA6C4073979FE80F16EEF0ED35FA2.pdf; Supplier: LCSC
H3 = PZ254V-12-10P: 排数:双排;总PIN位数:10;间距:2.54mm;插针结构:2x5P;行距:2.54mm;安装类型:直插;圆针/方针:方针;额定电流:-;额定电压:-;配合针长度:6mm;塑高:2.5mm;端接针长度:3mm;触头材质:黄铜;触头镀层:-;工作温度范围:-40℃~+105℃;颜色:黑色;; LCSC Part Name: 2.54mm 2x5P 直插 方针; Supplier Part: C492422; Manufacturer: XFCN(兴飞); Supplier Footprint: 直插,P=2.54mm; Supplier: LCSC; Number of Rows: 双排; Number of Pins: 10; Pitch: 2.54mm; Pin Structure: 2x5P; Row Spacing: 2.54mm; Mounting Type: 直插; Circluar Pins/Square Pins: 方针; Length of Mating Pin: 6mm; Insulation Height: 2.5mm; Length of End Connection Pin: 3mm; Contact Material: 黄铜; Operating Temperature Range: -40℃~+105℃; Color: 黑色
L2 = SDCL1608C47NJTDF: 电感值:47nH;精度:±5%;额定电流:300mA;饱和电流(Isat):-;直流电阻(DCR):700mΩ;; LCSC Part Name: 47nH ±5%; Supplier Part: C29683; Manufacturer: Sunlord(顺络); Supplier Footprint: 0603; Datasheet: https://atta.szlcsc.com/upload/public/pdf/source/20210916/2389196E6DC4CA1121B2D3610B126F46.pdf; Supplier: LCSC; Tolerance: ±5%; Rated Current: 300mA; DC Resistance (DCR): 700mΩ; Q @ Freq: 12@100MHz; Frequency - Self Resonant: 100MHz
LED2 LED3 = XL-1608UBC-04: 发光颜色:蓝灯;主波长:460nm~469nm;色温:-;功率:80mW;安装方式:正贴;; LCSC Part Name: 蓝灯 正贴; Supplier Part: C965807; Manufacturer: XINGLIGHT(成兴光); Supplier Footprint: 0603; Datasheet: https://atta.szlcsc.com/upload/public/pdf/source/20221102/D52C9F3BB075BE608C95388C1716C351.pdf; Supplier: LCSC; Emitted Color: 蓝灯; Lens Color: 无色透明; Dominant Wavelength: 460nm~469nm; Peak Wavelength: 475nm; Forward Current: 25mA; Power Dissipation: 80mW; Viewing Angle: 120°; Mounting Sytle: 正贴; Operating Temperature: -30℃~+85℃
Q1-Q6 = DTC043ZEBTL: 晶体管类型:1个NPN-预偏置;功率(Pd):150mW;集电极电流(Ic):100mA;集射极击穿电压(Vceo):50V;; LCSC Part Name: 1个NPN-预偏置 100mA 50V; Supplier Part: C96459; Manufacturer: ROHM(罗姆); Supplier Footprint: SOT-416FL; Supplier: LCSC; Transistor Type: 1个NPN-预偏置; Power Dissipation (Pd): 150mW; Collector Current (Ic): 100mA; Collector-Emitter Breakdown Voltage (Vceo): 50V
R9 R10 = RS-03K222JT: 阻值:2.2kΩ;精度:±5%;功率:100mW;温度系数:±100ppm/℃;; LCSC Part Name: 2.2kΩ ±5% 100mW; Supplier Part: C115003; Manufacturer: FH(风华); Supplier Footprint: 0603; Datasheet: https://atta.szlcsc.com/upload/public/pdf/source/20170620/1497944789720.pdf; Supplier: LCSC; Tolerance: ±5%; Power(Watts): 100mW; Temperature Coefficient: ±100ppm/℃; Overload Voltage (Max): 50V; Operating Temperature Range: -55℃~+155℃
R11 = RS-03K153JT: 阻值:15kΩ;精度:±5%;功率:100mW;温度系数:±100ppm/℃;; LCSC Part Name: 15kΩ ±5% 100mW; Supplier Part: C73802; Manufacturer: FH(风华); Supplier Footprint: 0603; Datasheet: https://atta.szlcsc.com/upload/public/pdf/source/20160606/1465200211556.pdf; Supplier: LCSC; Tolerance: ±5%; Power(Watts): 100mW; Temperature Coefficient: ±100ppm/℃; Overload Voltage (Max): 50V; Operating Temperature Range: -55℃~+155℃
R12 R22 R30 R31 = RS-03K513JT: 精度:±5%;阻值:51kΩ;温度系数:±100ppm/℃;功率:100mW;最大工作电压:50V;工作温度范围:-55℃~+155℃;; LCSC Part Name: 51KΩ(513) ±5%; Supplier Part: C118371; Manufacturer: FH(风华); Supplier Footprint: 0603; Datasheet: https://atta.szlcsc.com/upload/public/pdf/source/20171106/C118371_15099531602281092450.pdf; Supplier: LCSC; Tolerance: ±5%; Temperature Coefficient: ±100ppm/℃; Power(Watts): 100mW; Overload Voltage (Max): 50V; Operating Temperature Range: -55℃~+155℃
R13-R15 R20 R21 = RS-03000FT: 阻值:0Ω;精度:±1%;功率:100mW;; LCSC Part Name: 0Ω ±1% 100mW; Supplier Part: C136582; Manufacturer: FH(风华); Supplier Footprint: 0603; Datasheet: https://atta.szlcsc.com/upload/public/pdf/source/20171106/C136582_15099532019501092527.pdf; Supplier: LCSC; Tolerance: ±1%; Power(Watts): 100mW; Overload Voltage (Max): 50V; Operating Temperature Range: -55℃~+155℃
R16 = 0603WAF4701T5E: 电阻类型:厚膜电阻;阻值:4.7kΩ;精度:±1%;功率:100mW;; LCSC Part Name: 4.7kΩ ±1% 100mW; Supplier Part: C23162; Manufacturer: UNI-ROYAL(厚声); Supplier Footprint: 0603; Datasheet: https://atta.szlcsc.com/upload/public/pdf/source/20200306/C422600_1E6D84923E4A46A82E41ADD87F860B5C.pdf; Supplier: LCSC; Type: 厚膜电阻; Tolerance: ±1%; Power(Watts): 100mW; Temperature Coefficient: ±100ppm/℃; Overload Voltage (Max): 75V; Operating Temperature Range: -55℃~+155℃
R17 = 0805W8F0000T5E: 电阻类型:厚膜电阻;阻值:0Ω;精度:±1%;功率:125mW;; LCSC Part Name: 0Ω ±1% 125mW; Supplier Part: C17477; Manufacturer: UNI-ROYAL(厚声); Supplier Footprint: 0805; Datasheet: https://atta.szlcsc.com/upload/public/pdf/source/20200306/C422600_1E6D84923E4A46A82E41ADD87F860B5C.pdf; Supplier: LCSC; Type: 厚膜电阻; Tolerance: ±1%; Power(Watts): 125mW; Temperature Coefficient: ±800ppm/℃; Overload Voltage (Max): 150V; Operating Temperature Range: -55℃~+155℃
R19 = 0603WAF100JT5E: 电阻类型:厚膜电阻;阻值:10Ω;精度:±1%;功率:100mW;; LCSC Part Name: 10Ω ±1% 100mW; Supplier Part: C22859; Manufacturer: UNI-ROYAL(厚声); Supplier Footprint: 0603; Datasheet: https://atta.szlcsc.com/upload/public/pdf/source/20200306/C422600_1E6D84923E4A46A82E41ADD87F860B5C.pdf; Supplier: LCSC; Type: 厚膜电阻; Tolerance: ±1%; Power(Watts): 100mW; Temperature Coefficient: ±400ppm/℃; Overload Voltage (Max): 75V; Operating Temperature Range: -55℃~+155℃
R23 R24 = 0603WAF1003T5E: 电阻类型:厚膜电阻;阻值:100kΩ;精度:±1%;功率:100mW;; LCSC Part Name: 100kΩ ±1% 100mW; Supplier Part: C25803; Manufacturer: UNI-ROYAL(厚声); Supplier Footprint: 0603; Datasheet: https://atta.szlcsc.com/upload/public/pdf/source/20200306/C422600_1E6D84923E4A46A82E41ADD87F860B5C.pdf; Supplier: LCSC; Type: 厚膜电阻; Tolerance: ±1%; Power(Watts): 100mW; Temperature Coefficient: ±100ppm/℃; Overload Voltage (Max): 75V; Operating Temperature Range: -55℃~+155℃
R25 = 0603WAF3300T5E: 电阻类型:厚膜电阻;阻值:330Ω;精度:±1%;功率:100mW;; LCSC Part Name: 330Ω ±1% 100mW; Supplier Part: C23138; Manufacturer: UNI-ROYAL(厚声); Supplier Footprint: 0603; Datasheet: https://atta.szlcsc.com/upload/public/pdf/source/20200306/C422600_1E6D84923E4A46A82E41ADD87F860B5C.pdf; Supplier: LCSC; Type: 厚膜电阻; Tolerance: ±1%; Power(Watts): 100mW; Temperature Coefficient: ±100ppm/℃; Overload Voltage (Max): 75V; Operating Temperature Range: -55℃~+155℃
R27 = 0603WAF4702T5E: 电阻类型:厚膜电阻;阻值:47kΩ;精度:±1%;功率:100mW;; LCSC Part Name: 47kΩ ±1% 100mW; Supplier Part: C25819; Manufacturer: UNI-ROYAL(厚声); Supplier Footprint: 0603; Datasheet: https://atta.szlcsc.com/upload/public/pdf/source/20200306/C422600_1E6D84923E4A46A82E41ADD87F860B5C.pdf; Supplier: LCSC; Type: 厚膜电阻; Tolerance: ±1%; Power(Watts): 100mW; Temperature Coefficient: ±100ppm/℃; Overload Voltage (Max): 75V; Operating Temperature Range: -55℃~+155℃
R29 = 0603WAF1203T5E: 电阻类型:厚膜电阻;阻值:120kΩ;精度:±1%;功率:100mW;; LCSC Part Name: 120kΩ ±1% 100mW; Supplier Part: C25808; Manufacturer: UNI-ROYAL(厚声); Supplier Footprint: 0603; Datasheet: https://atta.szlcsc.com/upload/public/pdf/source/20200306/C422600_1E6D84923E4A46A82E41ADD87F860B5C.pdf; Supplier: LCSC; Type: 厚膜电阻; Tolerance: ±1%; Power(Watts): 100mW; Temperature Coefficient: ±100ppm/℃; Overload Voltage (Max): 75V; Operating Temperature Range: -55℃~+155℃
RF1 RF2 = BWIPX-1-001E: 连接器类型:板端;射频系列:IPEX;接口类型:内针;端口数量:1;阻抗:50Ω;频率-最大值:6GHz;样式:-;接口直径:-;接口长度/高度:-;工作温度范围:-;; LCSC Part Name: IPEX 内针 IPEX内针 天线座 IPEX-1 IPEX1 1代; Supplier Part: C496552; Manufacturer: BAT WIRELESS(蝙蝠无线); Supplier Footprint: SMD; Datasheet: https://atta.szlcsc.com/upload/public/pdf/source/20201223/C496552_05E5A9956EAE1A8819C5051D085B1DED.pdf; Supplier: LCSC; Connector Type: 板端; RF Series: IPEX; Interface Type: 内针; Number of Ports: 1; Impedance: 50Ω; Frequency-Max: 6GHz
U5 = ESDA6V8AV6: Supplier Part: C3021131; Manufacturer: TECH PUBLIC(台舟); Supplier Footprint: SOT-563; Datasheet: https://atta.szlcsc.com/upload/public/pdf/source/20220602/7DAC70CE9F6509F28726B722709467C3.pdf; Supplier: LCSC
U6 = SGM2019-3.3YC5G/TR: 输出类型:固定;输出极性:正;最大输入电压:5.5V;输出电压:3.3V;输出电流:250mA;电源纹波抑制比(PSRR):77dB;; LCSC Part Name: 输入5.5V 输出3.3V 250mA; Supplier Part: C122713; Manufacturer: SGMICRO(圣邦微); Supplier Footprint: SC-70-5; Datasheet: https://atta.szlcsc.com/upload/public/pdf/source/20190710/C403702_087BBF2DB9DA7C127CC5D0EF964E6982.pdf; Supplier: LCSC; Output Type: 固定; Output Polarity: 正; Number of Outputs: 1; Maximum Input Voltage: 5.5V; Output Voltage: 3.3V; Dropout Voltage: 400mV@(300mA); Output Current: 250mA; Power Supply Rejection Ratio (PSRR): 77dB
U7 = MIC29302WU: LCSC Part Name: 3A Fast-Response LDO Regulator; Supplier Part: C2995533; Manufacturer: UMW(友台半导体); Supplier Footprint: TO-263; Supplier: LCSC
U8 = SI2333CDS-T1-MS: 类型:P沟道;漏源电压(Vdss):18V;连续漏极电流(Id):7A;导通电阻(RDS(on)@Vgs,Id):22mΩ@4.5V;阈值电压(Vgs(th)@Id):1.4V;; LCSC Part Name: P沟道,18V,7A,大体积; Supplier Part: C5278008; Manufacturer: MSKSEMI(美森科); Supplier Footprint: SOT-23-3L; Datasheet: https://atta.szlcsc.com/upload/public/pdf/source/20221121/B6558BE2CCE35E335487FA51269C3700.pdf; Supplier: LCSC; Type: P沟道; Drain Source Voltage (Vdss): 18V; Continuous Drain Current (Id): 7A; Drain Source On Resistance (RDS(on)@Vgs,Id): 22mΩ@4.5V; Gate Threshold Voltage (Vgs(th)@Id): 1.4V
U9 = TXS0108EPWR: 电路数:1;每个电路通道数:8;电压(VCCA):1.4V~3.6V;电压(VCCB):1.65V~5.5V;数据速率:60Mbps;; LCSC Part Name: 60Mbps 8位双向电平转换器; Supplier Part: C17206; Manufacturer: TI(德州仪器); Supplier Footprint: TSSOP-20; Datasheet: http://www.ti.com/cn/lit/gpn/txs0108e; Supplier: LCSC; Channel Type: 双向; Number of Circuits: 1; Channels per Circuit: 8; Supply Voltage (VCCA): 1.4V~3.6V; Supply Voltage (VCCB): 1.65V~5.5V; Output Type: 开路漏极；推挽式; Data Rate: 60Mbps; Operating Temperature: -40℃~+85℃; Features: 自动方向检测
L1 = DLM0NSN900HY2D: 线路数:2;阻抗 @ 频率:90Ω@100MHz;直流电阻(DCR):4Ω;; Supplier Part: C882594; Manufacturer: muRata(村田); Supplier Footprint: SMD,0.85x0.65mm; Datasheet: https://atta.szlcsc.com/upload/public/pdf/source/20201228/C882594_876DA5E3F05FD239FA334CBAA78414B9.pdf; Supplier: LCSC; Number of Lines: 2; Impedance @ Frequency: 90Ω@100MHz; Current Rating: 100mA; DC Resistance (DCR): 4Ω; Voltage Rating - DC: 5V; Operating Temperature: -40℃~+85℃; Withstanding Voltage: 12.5V
R7 R8 = Res_0603: Supplier Footprint: 0603
U4 = EC800M

## Nets
3V3: C1.1 C2.2 C3.1 C7.2 C8.2 C41.2 H2.7 H2.8 R1.2 R2.2 R3.2 R4.1 R18.1 U1.2(VOUT(TAB)) U1.4(TAB) U2.8(VCC) U3.6(VBAT) U3.8(VDDA/DDA) U9.19(VCCB)
5V: C4.1 C5.1 C16.2 C17.2 C35.1 C36.2 C37.1 H1.2 R22.1 R26.2 U1.3(VIN) U6.1(IN) U7.2(IN) U8.2(S) USB1.A9(VBUS) USB1.B9(VBUS)
GND: C1.2 C2.1 C3.2 C4.2 C5.2 C6.2 C7.1 C8.1 C9.1 C10.1 C11.1 C12.1 C13.1 C14.1 C15.1 C16.1 C17.1 C18.1 C19.1 C20.1 C21.1 C22.1 C23.1 C24.1 C25.1 C26.2 C27.1 C28.1 C29.1 C30.1 C31.1 C33.1 C34.1 C35.2 C36.1 C38.1 C39.2 C40.2 C41.1 CARD1.5(GND) CARD1.9(GND) CARD1.10(GND) CARD1.11(GND) D1.2(A) D2.2(A) D3.2(A) D4.2(A) D5.2(A) D6.2(A) D7.2(A) D8.2(A) D9.2(A) D10.2 D11.1(K) H1.1 H2.1 H2.2 H3.1 LED1.1(K) Q1.2(E) Q2.2(E) Q3.2(E) Q4.2(E) Q5.2(E) Q6.2(E) R5.1 R6.1 R16.1 R25.1 R27.1 R29.1 R30.2 R31.1 RF1.2(GND) RF1.3(GND) RF2.2(GND) RF2.3(GND) SW1.2 U1.1(ADJ(GND)) U2.1(A0) U2.2(A1) U2.3(A2) U2.4(GND) U3.9(VSSA/SSA) U4.1(GND) U4.10(GND) U4.27(GND) U4.34(GND) U4.36(GND) U4.37(GND) U4.40(GND) U4.41(GND) U4.45(GND) U4.46(GND) U4.47(GND) U4.48(GND) U4.70(GND) U4.71(GND) U4.72(GND) U4.73(GND) U4.88(GND) U4.89(GND) U4.90(GND) U4.91(GND) U4.92(GND) U4.93(GND) U4.94(GND) U4.95(GND) U5.2 U6.2(GND) U7.3(GND) U7.6(GND) U9.11(GND) USB1.7(EH) USB1.A12(GND) USB1.B12(GND)
VBAT: C19.2 C20.2 C21.2 C22.2 C23.2 C26.1 C38.2 C39.1 D10.1 H3.2 LED2.2(A) LED3.2(A) R17.1 R23.2 R25.2 U7.4(OUT)
VBAT_EN: Q5.1(B) U3.52(PD2)
VBAT_MODULE: R17.2 U4.42(VBAT) U4.43(VBAT)
VBUS_CTRL: Q6.1(B) U3.54(PD4)
VDD_EXT: C40.1 D5.1(C) H3.10 R12.2 R28.2 U4.24(VDD_EXT) U9.2(VCCA)
ANT_GNSS: C33.2 R21.1 U4.2(ANT_GNSS)
ANT_MAIN: C30.2 R20.1 U4.35(ANT_MAIN)
CC1: R5.2 USB1.A5(CC1)
CC2: R6.2 USB1.B5(CC2)
CTS_MCU: U3.58(PB4) U9.17(B3)
DBG_RXD: D3.1(C) H3.7 U4.38(DBG_RXD)
DBG_TXD: D6.1(C) H3.8 U4.39(DBG_TXD)
DCD_MCU: U3.27(PB0) U9.16(B4)
DEBUG_RX: H2.4 U3.20(PA3)
DEBUG_TX: H2.6 U3.19(PA2)
DTR_MCU: U3.29(PB2) U9.14(B6)
GNSS_ANT_EN: R18.2 U3.53(PD3) U6.3(EN)
GNSS_VDD_3V3: C18.2 C24.2 C25.2 C29.2 R19.1 U6.5(OUT)
I2C1_SCL: R2.1 U2.6(SCL) U3.37(PA9)
I2C1_SDA: R1.1 U2.5(SDA) U3.42(PA10)
I2C1_WP: R3.1 U2.7(WP) U3.36(PA8)
MAIN_CTS: U4.22(MAIN_CTS) U9.4(A3)
MAIN_DCD: U4.21(MAIN_DCD) U9.5(A4)
MAIN_DTR: U4.19(MAIN_DTR) U9.7(A6)
MAIN_RI: U4.20(MAIN_RI) U9.6(A5)
MAIN_RTS: U4.23(MAIN_RTS) U9.3(A2)
MAIN_RXD: U4.17(MAIN_RXD) U9.9(A8)
MAIN_TXD: U4.18(MAIN_TXD) U9.8(A7)
MCU_USB_DM: L1.4 U3.43(PA11[PA9])
MCU_USB_DP: L1.1 U3.44(PA12[PA10])
NET_STATUS: Q1.1(B) U4.16(NET_STATUS)
NRST: C6.1 SW1.1 U3.12(NRST)
ON/OFF_MCU: Q3.1(B) U3.50(PD0)
PWRKEY: C28.2 D1.1(C) H3.3 Q3.3(C) U4.7(PWRKEY)
RESET_MCU: Q4.1(B) U3.51(PD1)
RESET_N: D4.1(C) H3.9 Q4.3(C) U4.15(RESET_N)
RI_MCU: U3.28(PB1) U9.15(B5)
RTS_MCU: U3.57(PB3) U9.18(B2)
RXD_MCU: U3.26(PC5) U9.13(B7)
STATUS: Q2.1(B) U4.25(STATUS)
SWCLK: H2.5 U3.46(PA14-BOOT0)
SWDIO: H2.3 U3.45(PA13)
TXD_MCU: U3.25(PC4) U9.12(B8)
USB_BOOT: D9.1(C) H4.2 U4.82(USB_BOOT/KP_MKOUT[4])
USB_DM_TEST: D7.1(C) H3.6 R8.1
USB_DP_TEST: D2.1(C) H3.5 R7.1
USB_VBUS: D8.1(C) H3.4 U4.61(USB_VBUS) U8.3(D)
USIM1_CLK: R14.1 U4.13(USIM1_CLK)
USIM1_DATA: R15.1 U4.11(USIM1_DATA)
USIM1_DET: CARD1.8(SW) R12.1 U4.79(USIM1_DET) U5.3
USIM1_RST: R13.1 U4.12(USIM1_RST)
USIM1_VDD: C12.2 CARD1.1(VCC) R11.2 U4.14(USIM1_VDD) U5.1
$1N2161: C11.2 U3.10(PF0-OSC_IN) X1.1(OSC1)
$1N15878: LED1.2(A) R4.2
$1N19614: C10.2 U3.11(PF1-OSC_OUT) X1.2(OSC2)
$1N19655: C9.2 U3.7(VREF+)
$2N14940: L1.2 R7.2 U4.59(USB_DP)
$2N14988: L1.3 R8.2 U4.60(USB_DM)
$3N1995: C13.2 CARD1.2(RST) R13.2 U5.5
$3N1996: C14.2 CARD1.3(CLK) R14.2 U5.4
$3N2017: H4.1 R16.2
$3N2032: C15.2 CARD1.7(I/O) R11.1 R15.2 U5.6
$3N2037: C27.2 U6.4(BP/FB)
$3N3863: C31.2 R20.2 RF1.1(SIG)
$3N3867: C32.1 C34.2 R21.2
$3N3871: C32.2 D11.2(A) L2.2 RF2.1(SIG)
$3N3874: L2.1 R19.2
$3N4701: Q5.3(C) R22.2 U7.1(EN)
$3N7617: R28.1 R29.2 U9.10(OE)
$3N7638: R31.2 U9.20(B1)
$3N7643: R30.1 U9.1(A1)
$3N8139: Q6.3(C) R24.1 R26.1
$3N8153: C37.2 R24.2 U8.1(G)
$3N12837: R23.1 R27.2 U7.5(ADJ)
$3N22714: Q1.3(C) R9.1
$3N22716: LED2.1(K) R9.2
$3N22754: Q2.3(C) R10.1
$3N22756: LED3.1(K) R10.2

Not connected (* = marked no-connect by the designer): CARD1 6(VPP)*; U3 1(PC11)* 2(PC12)* 3(PC13)* 4(PC14-OSC32_IN)* 5(PC15-OSC32_OUT)* 13(PC0)* 14(PC1)* 15(PC2)* 16(PC3)* 17(PA0)* 18(PA1)* 21(PA4)* 22(PA5)* 23(PA6)* 24(PA7)* 30(PB10)* 31(PB11)* 32(PB12)* 33(PB13)* 34(PB14)* 35(PB15)* 38(PC6)* 39(PC7)* 40(PD8)* 41(PD9)* 47(PA15)* 48(PC8)* 49(PC9)* 55(PD5)* 56(PD6)* 59(PB5)* 60(PB6)* 61(PB7)* 62(PB8)* 63(PB9)* 64(PC10)*; U4 3(MIC_P)* 4(MIC_N)* 5(SPK_P)* 6(SPK_N)* 8(CAM_VDD)* 9(ADC0)* 26(RESERVED)* 28(AUX_RXD)* 29(AUX_TXD)* 30(PCM_CLK)* 31(PCM_SYNC)* 32(PCM_DIN)* 33(PCM_DOUT)* 44(RESERVED)* 49(LCD_RST)* 50(LCD_SPI_DOUT)* 51(LCD_SPI_RS)* 52(LCD_SPI_CS)* 53(LCD_SPI_CLK)* 54(CAM_MCLK)* 55(CAM_SPI_DATA0)* 56(CAM_SPI_DATA1)* 57(CAM_I2C_SCL)* 58(CAM_I2C_SDA)* 62(USIM2_CLK)* 63(USIM2_RST)* 64(USIM2_DATA)* 65(USIM2_VDD)* 66(I2C2_SDA)* 67(I2C2_SCL)* 68(I2C1_SCL)* 69(I2C1_SDA)* 74(KP_MKOUT[5])* 75(KP_MKIN[5])* 76(KP_MKOUT[2])* 77(KP_MKIN[2])* 78(LCD_TE)* 80(CAM_SPI_CLK)* 81(CAM_PWDN)* 83(KP_MKIN[4])* 84(KP_MKIN[3])* 85(KP_MKOUT[3])* 86(KP_MKOUT[1])* 87(KP_MKIN[1])* 96(ADC1)* 97(RESERVED)* 98(RESERVED)* 99(RESERVED)* 100(RESERVED)* 101(RESERVED)* 102(RESERVED)* 103(RESERVED)* 104(GRFC2)* 105(GRFC1)* 106(RESERVED)* 107(RESERVED)* 108(RESERVED)* 109(RESERVED)*

## Notes on the sheets
sheet 1
- 电源
- MCU
- 存储模块
- 调试接口
- 按键
- 重启按键
- 指示灯
- TYPEC
sheet 2
- EC800M-CN
sheet 3
- 指示灯
- SIM卡
- 测试点
- 天线
- MCU控制
- 电源
- Close to VBAT pins.
- 0.05pF
- MCU通信
